# EAGLE design dc25-darknet-dialer-eaglev8 (EAGLE 7.7.0)
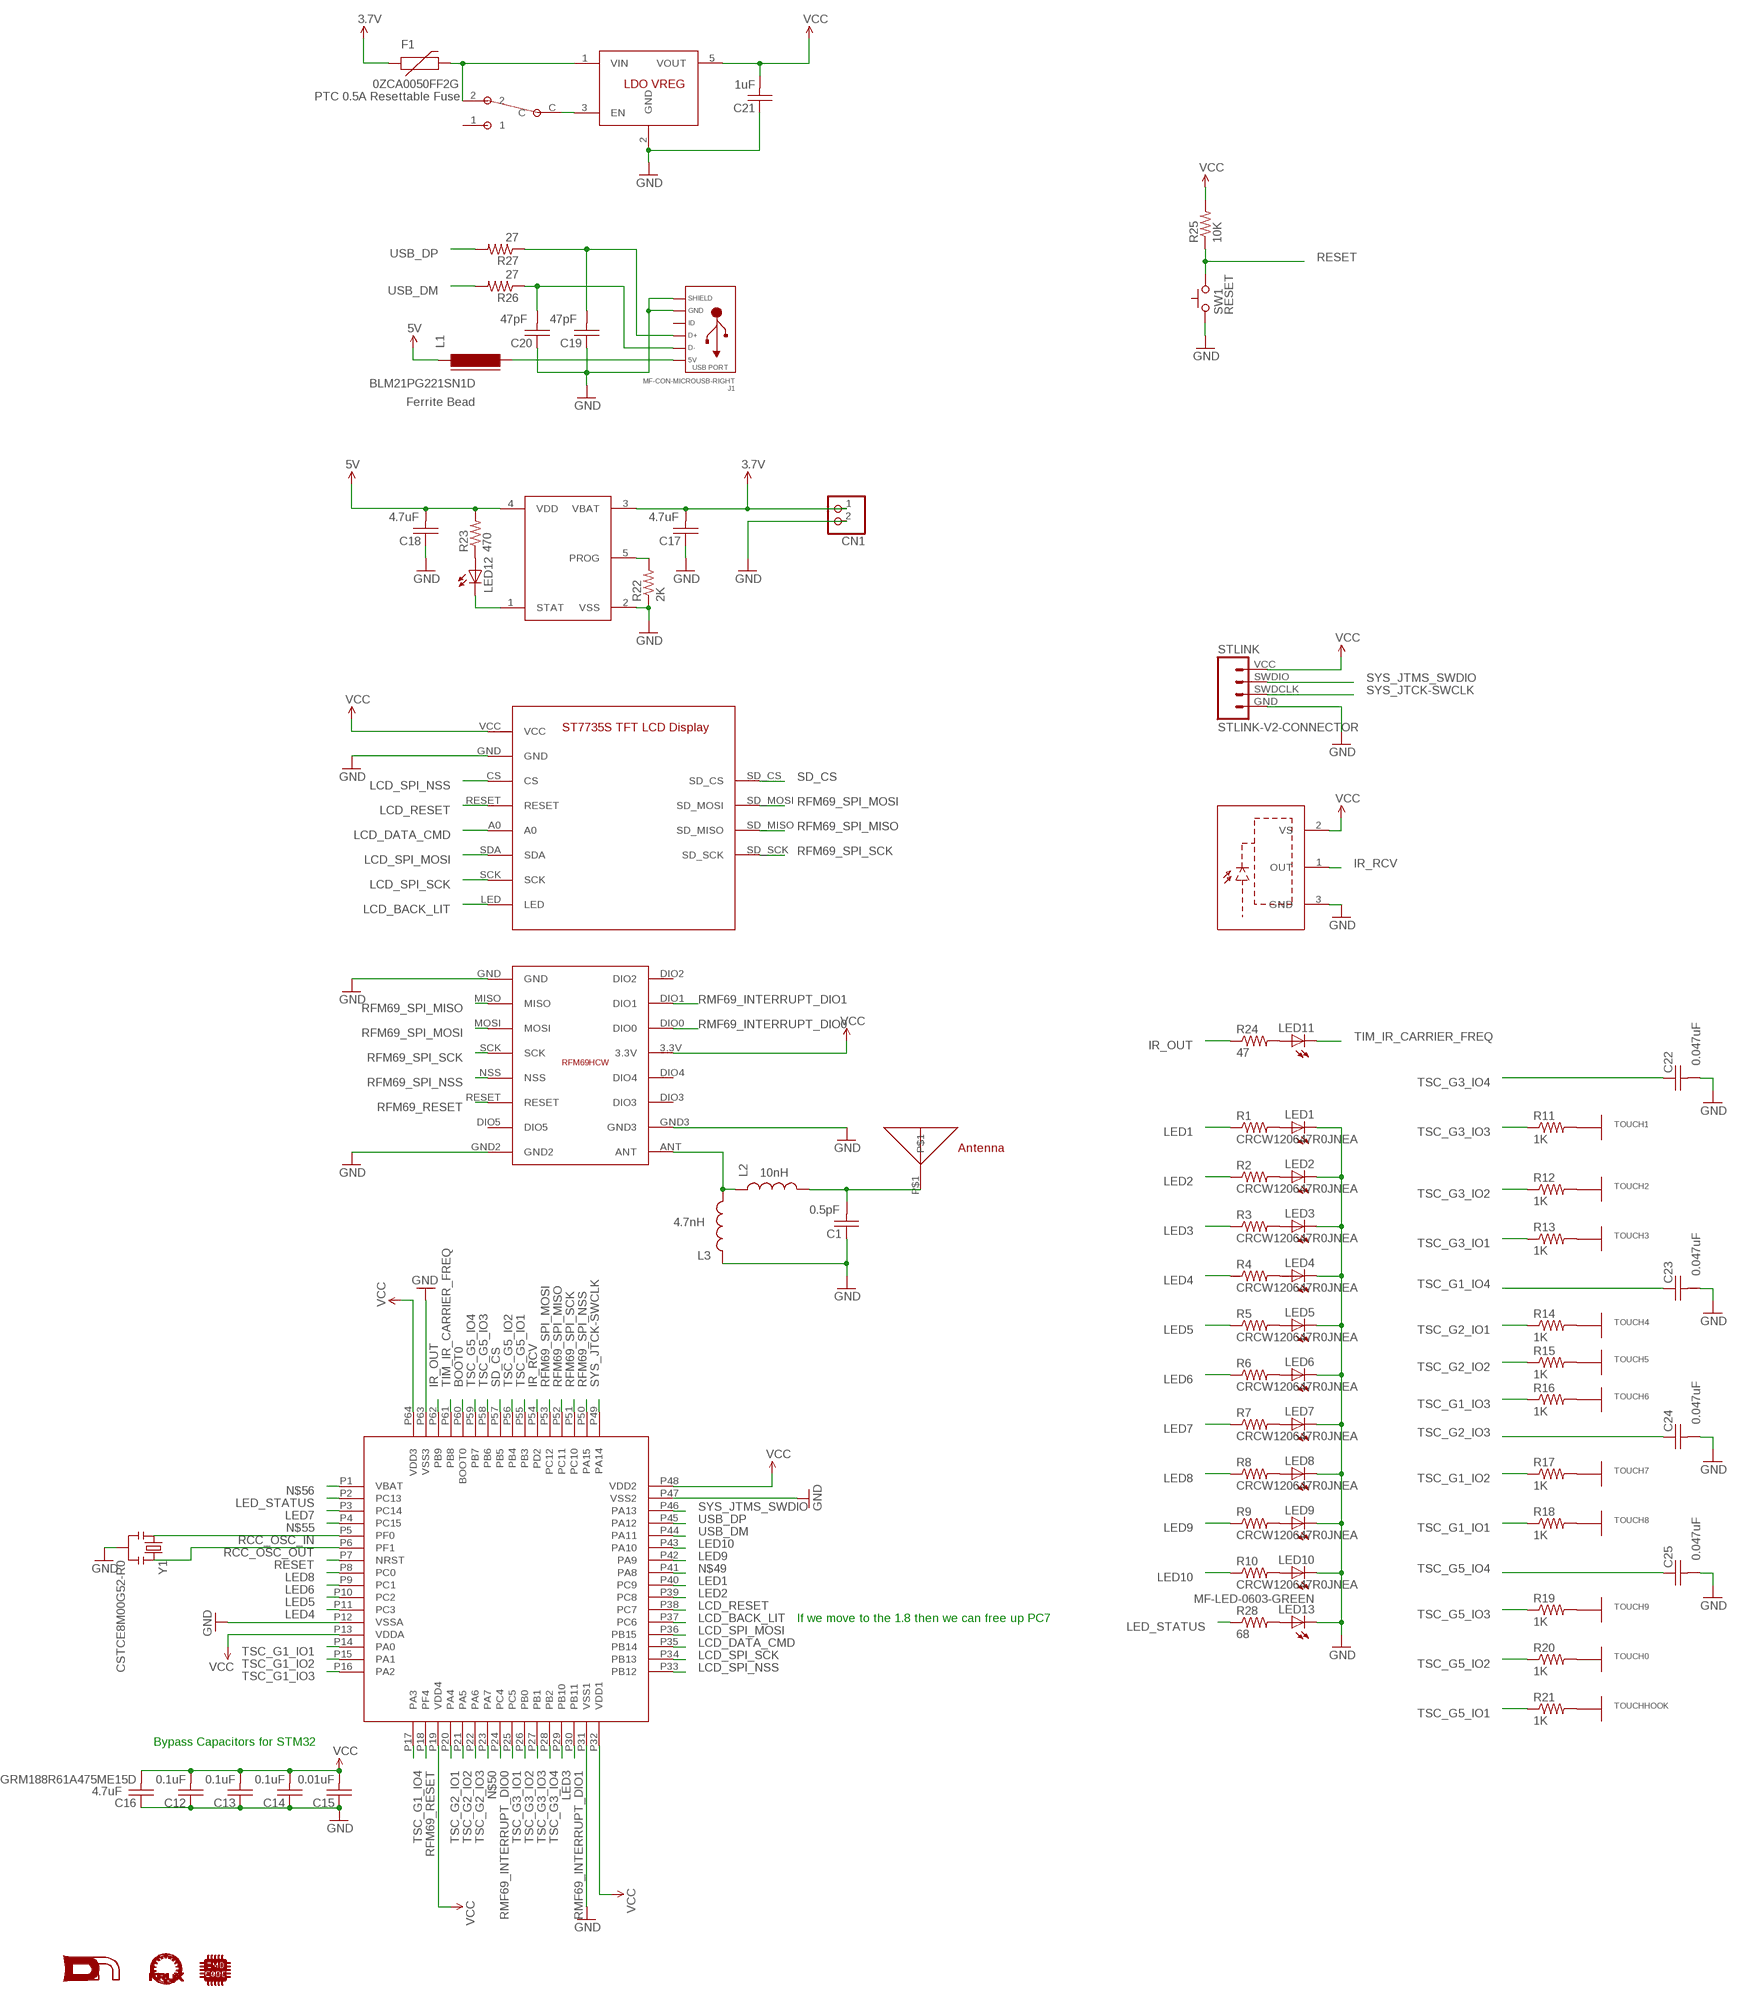
[diagram p0: schematic, sheet 1]

## Parts
C1  251R14S0R5BV4T  C-USC0603  [C0603]
C12  0.1uF  C-USC0603  [C0603]
C13  0.1uF  C-USC0603  [C0603]
C14  0.1uF  C-USC0603  [C0603]
C15  0.01uF  C-USC0603  [C0603]
C16  GRM188R61A475ME15D  C-USC0603  [C0603]
C17  GRM188R61A475ME15D  C-USC0603  [C0603]
C18  GRM188R61A475ME15D  C-USC0603  [C0603]
C19  C0603C470J3GACTU  C-USC0603  [C0603]
C20  C0603C470J3GACTU  C-USC0603  [C0603]
C21  1uF  C-USC0603  [C0603]
C22  C0603C473J3RACAUTO  C-USC0603  [C0603]
C23  C0603C473J3RACAUTO  C-USC0603  [C0603]
C24  C0603C473J3RACAUTO  C-USC0603  [C0603]
C25  C0603C473J3RACAUTO  C-USC0603  [C0603]
CN1  JST_2PIN-THM-RA  [JST-PH-2-THM-RA]
F1  0ZCA0050FF2G  PTCSMD  [PTC-1206]
J1  MF-CON-MICROUSB-RIGHT  USB_MICRO_RIGHT  [MICROUSB-RIGHT]
L1  BLM21PG221SN1D  FERRITE-0603  [FB603]
L2  CI160808-10NJ  INDUCTOR0603  [0603]
L3  CI160808-4N7D  INDUCTOR0603  [0603]
LED1  LEDREVERSEMOUNT  [GULLWING_LED]
LED2  LEDREVERSEMOUNT  [GULLWING_LED]
LED3  LEDREVERSEMOUNT  [GULLWING_LED]
LED4  LEDREVERSEMOUNT  [GULLWING_LED]
LED5  LEDREVERSEMOUNT  [GULLWING_LED]
LED6  LEDREVERSEMOUNT  [GULLWING_LED]
LED7  LEDREVERSEMOUNT  [GULLWING_LED]
LED8  LEDREVERSEMOUNT  [GULLWING_LED]
LED9  LEDREVERSEMOUNT  [GULLWING_LED]
LED10  LEDREVERSEMOUNT  [GULLWING_LED]
LED11  LED5MM  [LED5MM]
LED12  MF-LED-0603-GREEN  LED0603  [LED-0603]
LED13  MF-LED-0603-GREEN  LED0603  [LED-0603]
R1  CRCW120647R0JNEA  RESISTOR1206  [1206]
R2  CRCW120647R0JNEA  RESISTOR1206  [1206]
R3  CRCW120647R0JNEA  RESISTOR1206  [1206]
R4  CRCW120647R0JNEA  RESISTOR1206  [1206]
R5  CRCW120647R0JNEA  RESISTOR1206  [1206]
R6  CRCW120647R0JNEA  RESISTOR1206  [1206]
R7  CRCW120647R0JNEA  RESISTOR1206  [1206]
R8  CRCW120647R0JNEA  RESISTOR1206  [1206]
R9  CRCW120647R0JNEA  RESISTOR1206  [1206]
R10  CRCW120647R0JNEA  RESISTOR1206  [1206]
R11  1K  RESISTOR0603-RES  [0603-RES]
R12  1K  RESISTOR0603-RES  [0603-RES]
R13  1K  RESISTOR0603-RES  [0603-RES]
R14  1K  RESISTOR0603-RES  [0603-RES]
R15  1K  RESISTOR0603-RES  [0603-RES]
R16  1K  RESISTOR0603-RES  [0603-RES]
R17  1K  RESISTOR0603-RES  [0603-RES]
R18  1K  RESISTOR0603-RES  [0603-RES]
R19  1K  RESISTOR0603-RES  [0603-RES]
R20  1K  RESISTOR0603-RES  [0603-RES]
R21  1K  RESISTOR0603-RES  [0603-RES]
R22  2K  RESISTOR0603-RES  [0603-RES]
R23  470  RESISTOR0603-RES  [0603-RES]
R24  47  R-US_0207/7  [0207/7]
R25  10K  RESISTOR0603-RES  [0603-RES]
R26  27  RESISTOR0603-RES  [0603-RES]
R27  27  RESISTOR0603-RES  [0603-RES]
R28  68  RESISTOR0603-RES  [0603-RES]
STLINK  STLINK-V2-CONNECTOR  [1X04]
SW1  RESET  SWITCH_TACTILETACTILE-2PIN-NARROW  [TACTILE-2PIN-NARROW]
TOUCH0  CAP_TOUCH0  [CAP_TOUCH_PAD_0]
TOUCH1  CAP_TOUCH1  [CAP_TOUCH_PAD_1]
TOUCH2  CAP_TOUCH2  [CAP_TOUCH_PAD_2]
TOUCH3  CAP_TOUCH3  [CAP_TOUCH_PAD_3]
TOUCH4  CAP_TOUCH4  [CAP_TOUCH_PAD_4]
TOUCH5  CAP_TOUCH5  [CAP_TOUCH_PAD_5]
TOUCH6  CAP_TOUCH6  [CAP_TOUCH_PAD_6]
TOUCH7  CAP_TOUCH7  [CAP_TOUCH_PAD_7]
TOUCH8  CAP_TOUCH8  [CAP_TOUCH_PAD_8]
TOUCH9  CAP_TOUCH9  [CAP_TOUCH_PAD_9]
TOUCHHOOK  CAP_TOUCHHOOK  [CAP_TOUCH_PAD_HOOK]
U1  BU33SD5WG-TR  TLV702  [SOT23-5]
U2  MCP73831T-5ACI/OT  DS21984E  [SOT23-5]
U3  SOP22FLAT  [IR-MODULE_FLAT]
U$1  DN_LOGO  [DN_LOGO]
U$2  STM32F302RBT6  STM32F302XC  [LQFP64]
U$11  SWITCH_SPDT  [SPDT_SSAJ120100]
U$12  KRUX_LOGO  [KRUX_LOGO]
U$15  RFM69HCWRFN69HCWSMD  [16PIN-PCB-SMD]
U$21  0915AT43A0026E  CHIP_ANTENNA  [CHIP_ANTENNA_1.8X8MM]
U$22  ST7735S_LCD_MODULE  [ST7735S_LCD_DISPLAY]
U$23  CMD_C0DE_LOGO  [CMD_C0DE_LOGO]
Y1  CSTCE8M00G52-R0  RESONATORSMD  [RESONATOR-SMD]

## Nets
ANT: L2.1 L3.2 U$15.ANT
BOOT0: U$2.P60(BOOT0)
GND: C1.1 C12.1 C13.1 C14.1 C15.1 C16.1 C17.1 C18.1 C19.1 C20.1 C21.1 C22.2 C23.2 C24.2 C25.2 CN1.2 J1.5(GND) J1.S1(SLD) J1.S2(SLD) J1.S3(SLD) J1.S4(SLD) J1.S5(SLD) J1.S6(SLD) L3.1 LED1.C LED2.C LED3.C LED4.C LED5.C LED6.C LED7.C LED8.C LED9.C LED10.C LED13.C R22.1 STLINK.GND SW1.P$2(C) U1.2(GND) U2.2(VSS) U3.3(GND) U$2.P12(VSSA) U$2.P31(VSS1) U$2.P47(VSS2) U$2.P63(VSS3) U$15.GND U$15.GND2 U$15.GND3 U$22.GND Y1.2
IR_OUT: R24.1 U$2.P62(PB9)
IR_RCV: U3.1(OUT) U$2.P54(PD2)
LCD_BACK_LIT: U$2.P37(PC6) U$22.LED
LCD_DATA_CMD: U$2.P35(PB14) U$22.A0
LCD_RESET: U$2.P38(PC7) U$22.RESET
LCD_SPI_MOSI: U$2.P36(PB15) U$22.SDA
LCD_SPI_NSS: U$2.P33(PB12) U$22.CS
LCD_SPI_SCK: U$2.P34(PB13) U$22.SCK
LED1: R1.1 U$2.P40(PC9)
LED2: R2.1 U$2.P39(PC8)
LED3: R3.1 U$2.P29(PB10)
LED4: R4.1 U$2.P11(PC3)
LED5: R5.1 U$2.P10(PC2)
LED6: R6.1 U$2.P9(PC1)
LED7: R7.1 U$2.P3(PC14)
LED8: R8.1 U$2.P8(PC0)
LED9: R9.1 U$2.P42(PA9)
LED10: R10.1 U$2.P43(PA10)
LED_STATUS: R28.1 U$2.P2(PC13)
N$1: R11.2 TOUCH1.PAD(TOUCH)
N$2: R12.2 TOUCH2.PAD(TOUCH)
N$3: R13.2 TOUCH3.PAD(TOUCH)
N$4: R14.2 TOUCH4.PAD(TOUCH)
N$5: R15.2 TOUCH5.PAD(TOUCH)
N$6: R16.2 TOUCH6.PAD(TOUCH)
N$7: R17.2 TOUCH7.PAD(TOUCH)
N$8: R18.2 TOUCH8.PAD(TOUCH)
N$9: R19.2 TOUCH9.PAD(TOUCH)
N$10: R20.2 TOUCH0.PAD(TOUCH)
N$11: R21.2 TOUCHHOOK.P$1(TOUCH)
N$12: LED1.A R1.2
N$13: LED2.A R2.2
N$14: LED3.A R3.2
N$15: LED4.A R4.2
N$16: LED5.A R5.2
N$17: LED6.A R6.2
N$18: LED7.A R7.2
N$19: LED8.A R8.2
N$20: LED9.A R9.2
N$21: LED10.A R10.2
N$22: R22.2 U2.5(PROG)
N$23: LED11.A R24.2
N$24: LED12.A R23.1
N$25: LED12.C U2.1(STAT)
N$26: C19.2 J1.3(D+) R27.1
N$27: C20.2 J1.2(D-) R26.1
N$28: J1.1(5V) L1.2
N$29: LED13.A R28.2
N$30: F1.2 U1.1(VIN) U$11.2
N$31: C1.2 L2.2 U$21.P$1
N$32: U1.3(EN) U$11.C
N$49: U$2.P41(PA8)
N$50: U$2.P23(PA7)
N$55: U$2.P4(PC15)
N$56: U$2.P1(VBAT)
RCC_OSC_IN: U$2.P5(PF0) Y1.1
RCC_OSC_OUT: U$2.P6(PF1) Y1.3
RESET: R25.1 SW1.P$1(A) U$2.P7(NRST)
RFM69_RESET: U$2.P18(PF4) U$15.RESET
RFM69_SPI_MISO: U$2.P52(PC11) U$15.MISO U$22.SD_MISO
RFM69_SPI_MOSI: U$2.P53(PC12) U$15.MOSI U$22.SD_MOSI
RFM69_SPI_NSS: U$2.P50(PA15) U$15.NSS
RFM69_SPI_SCK: U$2.P51(PC10) U$15.SCK U$22.SD_SCK
RMF69_INTERRUPT_DIO0: U$2.P24(PC4) U$15.DIO0
RMF69_INTERRUPT_DIO1: U$2.P30(PB11) U$15.DIO1
SD_CS: U$2.P57(PB5) U$22.SD_CS
SYS_JTCK-SWCLK: STLINK.SWDCLK U$2.P49(PA14)
SYS_JTMS_SWDIO: STLINK.SWDIO U$2.P46(PA13)
TIM_IR_CARRIER_FREQ: LED11.K(C) U$2.P61(PB8)
TSC_G1_IO1: R18.1 U$2.P14(PA0)
TSC_G1_IO2: R17.1 U$2.P15(PA1)
TSC_G1_IO3: R16.1 U$2.P16(PA2)
TSC_G1_IO4: C23.1 U$2.P17(PA3)
TSC_G2_IO1: R14.1 U$2.P20(PA4)
TSC_G2_IO2: R15.1 U$2.P21(PA5)
TSC_G2_IO3: C24.1 U$2.P22(PA6)
TSC_G3_IO1: R13.1 U$2.P25(PC5)
TSC_G3_IO2: R12.1 U$2.P26(PB0)
TSC_G3_IO3: R11.1 U$2.P27(PB1)
TSC_G3_IO4: C22.1 U$2.P28(PB2)
TSC_G5_IO1: R21.1 U$2.P55(PB3)
TSC_G5_IO2: R20.1 U$2.P56(PB4)
TSC_G5_IO3: R19.1 U$2.P58(PB6)
TSC_G5_IO4: C25.1 U$2.P59(PB7)
USB_DM: R26.2 U$2.P44(PA11)
USB_DP: R27.2 U$2.P45(PA12)
VCC: C12.2 C13.2 C14.2 C15.2 C16.2 C21.2 R25.2 STLINK.VCC U1.5(VOUT) U3.2(VS) U$2.P13(VDDA) U$2.P19(VDD4) U$2.P32(VDD1) U$2.P48(VDD2) U$2.P64(VDD3) U$15.3.3V U$22.VCC
VCC0: C18.2 L1.1 R23.2 U2.4(VDD) ; supply symbol labelled 5V
VCC1: C17.2 CN1.1 F1.1 U2.3(VBAT) ; supply symbol labelled 3.7V
Unconnected: J1.4(ID) U$11.1 U$15.DIO2 U$15.DIO3 U$15.DIO4 U$15.DIO5

## Notes on the sheet
- PTC 0.5A Resettable Fuse
- 47pF | 47pF
- Ferrite Bead
- 4.7uF | 4.7uF
- 0.047uF
- 10nH
- 0.5pF
- 4.7nH
- 0.047uF
- 0.047uF
- 0.047uF
- If we move to the 1.8 then we can free up PC7
- Bypass Capacitors for STM32
- 4.7uF

## Library data of the parts
C1 C12-C25 = darknet_parts_library:C-US: CAPACITOR, American symbol
CN1 = adafruit:JST_2PIN: JST 2-Pin Connectors of various flavors SMT-RA (S2B-PH-SM4) 4UConnector #17311 SMT (B2B-PH-SM4) THM-RA (S2B-PH) THM (B2B-PH)
F1 = SparkFun:PTC: Resettable Fuse PTC Resettable Fuse. Spark Fun Electronics SKU : COM-08357
J1 = MF_Connectors:USB: Library: MF_Connectors Description: 5 Pin USB Connectors. SLD is the shield connection. Usually tied to ground through a small ferrite bead.; HOUSEPART: YES; MPN: MF-CON-MICROUSB-RIGHT; POPULATE: 1; URL: https://factory.macrofab.com/part/MF-CON-MICROUSB-RIGHT
L1 = dp_devices:FERRITE: Ferrite bead in various packages
L2 L3 = darknet_parts_library:INDUCTOR: Inductors Basic Inductor/Choke - 0603 and 1206. Footprints are not proven and vary greatly between part numbers.
LED1-LED13 = SYNShop:LED: LEDs Standard schematic elements and footprints for 5mm, 3mm, 1206, and 0603 sized LEDs. 5mm - Spark Fun Electronics SKU : COM-00529 (and others)
R1-R23 R25-R28 = darknet_parts_library:RESISTOR: Resistor Basic schematic elements and footprints for 0603, 1206, and PTH resistors.
R24 = darknet_parts_library:R-US_: RESISTOR, American symbol
STLINK = darknet_parts_library:STLINK-V2-CONNECTOR
SW1 = SYNShop:SWITCH_TACTILE
TOUCH0 TOUCH1-TOUCH9 TOUCHHOOK = darknet_parts_library:CAP_TOUCH
U1 = darknet_parts_library:TLV702
U2 = darknet_parts_library:DS21984E
U3 = darknet_parts_library:SOP22
U$1 = SYNShop:DN_LOGO
U$2 = darknet_parts_library:STM32F302XC
U$11 = darknet_parts_library:SWITCH_SPDT
U$12 = darknet_parts_library:KRUX_LOGO
U$15 = SYNShop:RFM69HCW
U$21 = darknet_parts_library:CHIP_ANTENNA
U$22 = darknet_parts_library:ST7735S_LCD_MODULE
U$23 = darknet_parts_library:CMD_C0DE_LOGO
Y1 = SparkFun:RESONATOR: Resonator Small SMD resonator. This is the itty bitty 10/20MHz resonators with built in caps. CSTCE10M0G55 and CSTCE20M0V53. Footprint has been reviewed closely but hasn't been tested yet.

## Board
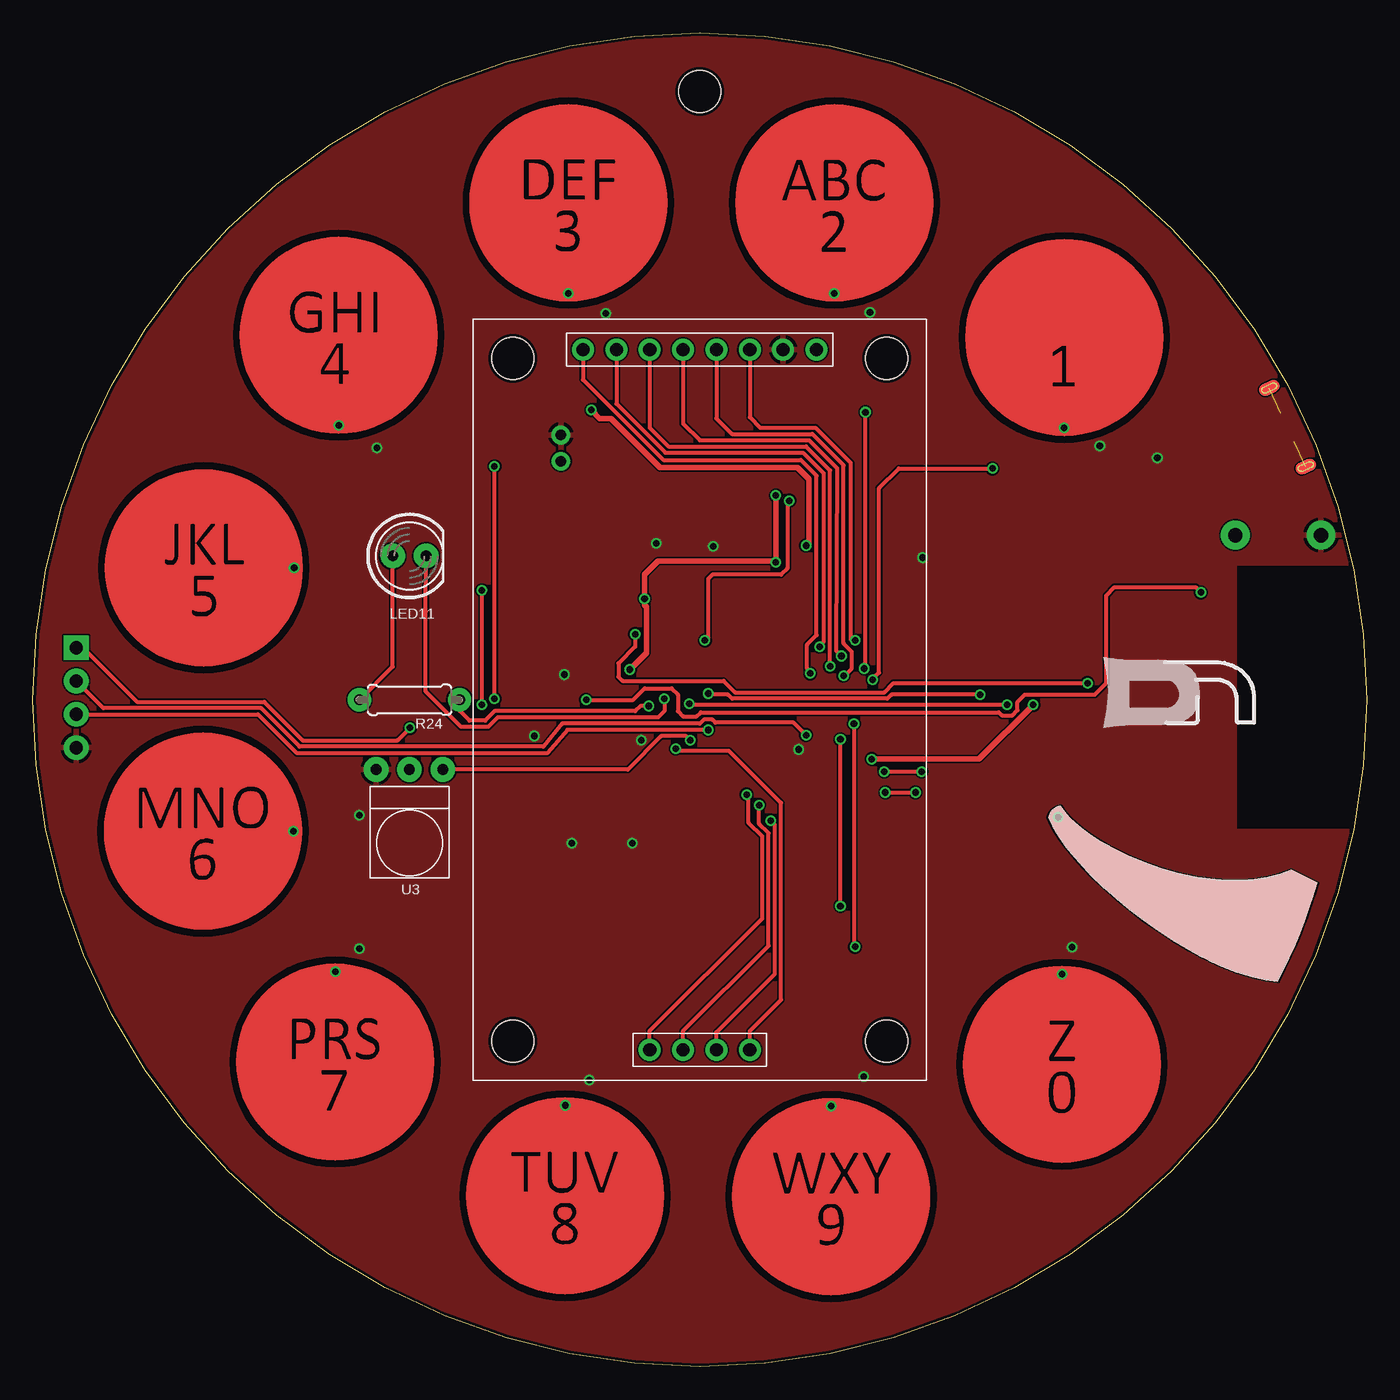
[diagram p1: board, top side]
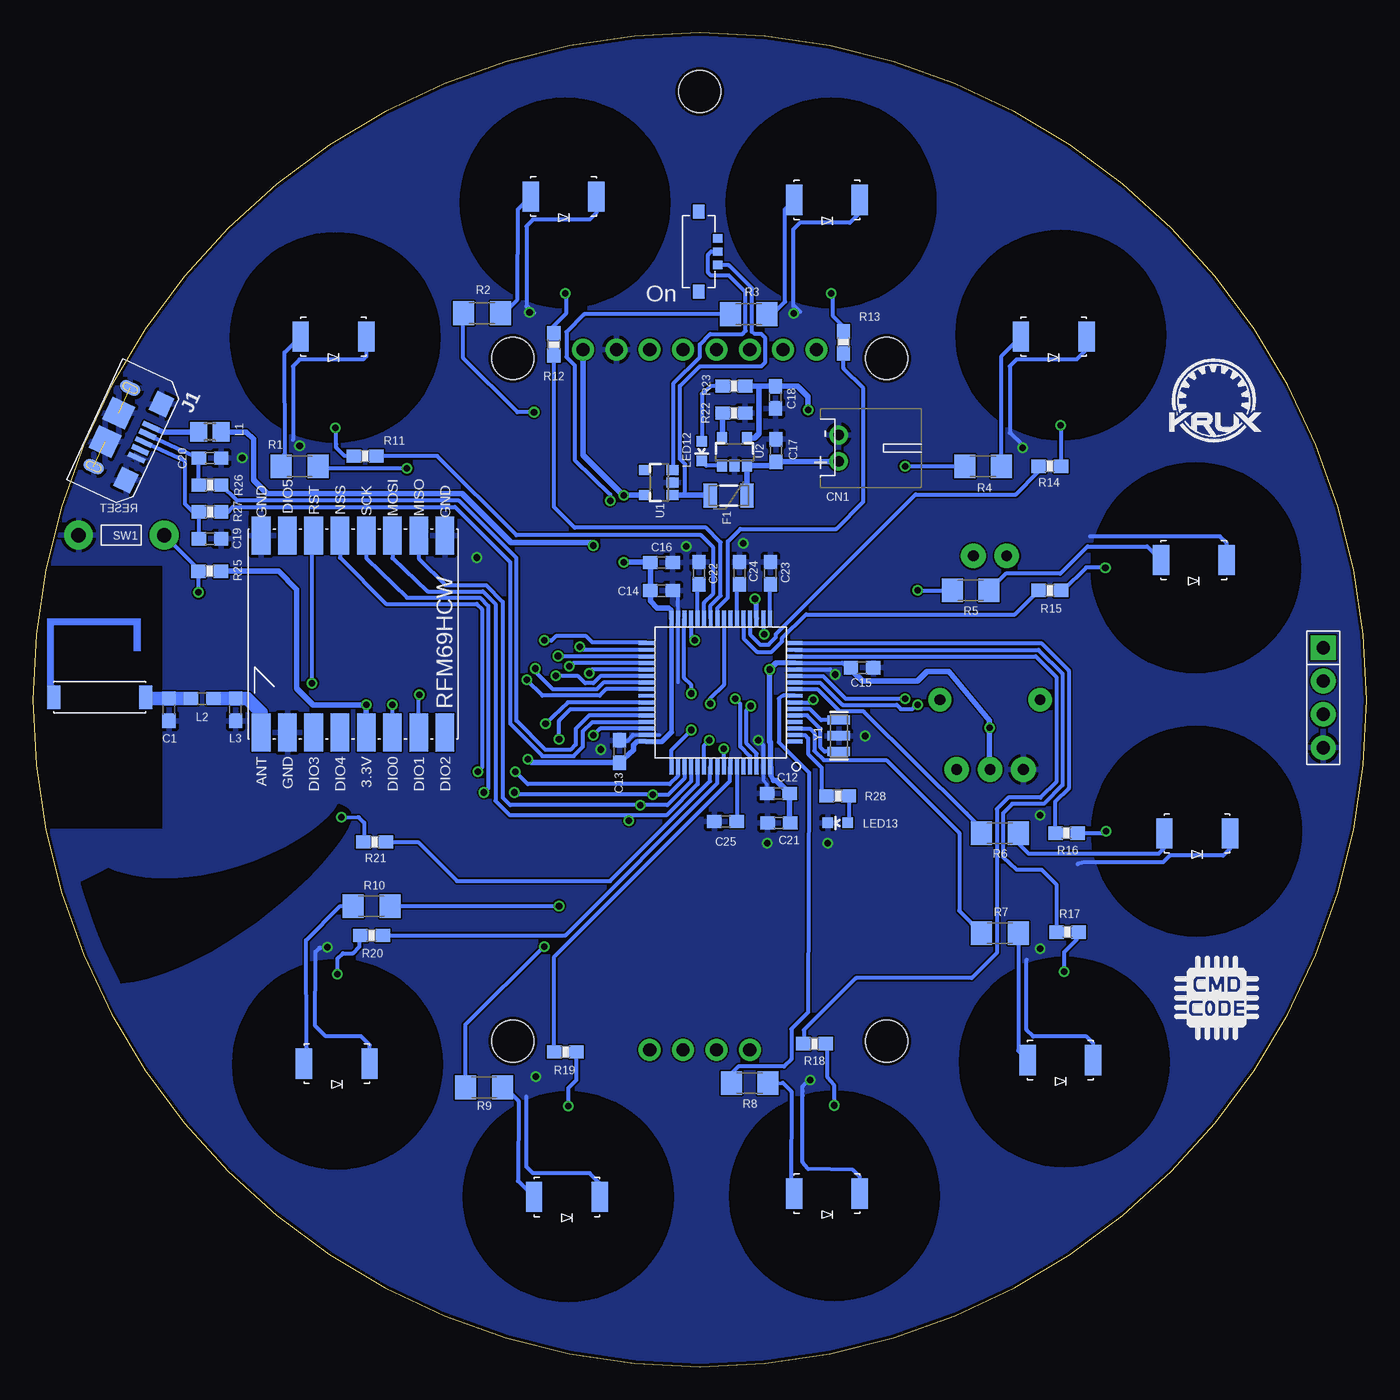
[diagram p2: board, bottom side, seen from below]

Size 101.6 x 101.6 mm. Coordinates in mm from the lower left corner, seen from the top.
Outline: 50.8,101.6 arc-180 50.8,0 arc-180 50.8,101.6
Copper layers (1*16): Top 0.035mm / dielectric 1.5mm / Bottom 0.035mm
Design rules "MF_Standard_2_Layer": minimum track width 5mil, minimum drill 12mil, track to track 5mil, track to pad 5mil, pad to pad 5mil, via to via 5mil, smd to smd 0mil, copper to edge 10mil, drill to drill 10mil, minimum pad ring 6mil, minimum via ring 6mil, stop-mask expansion 2mil, vias tented up to drill 25mil, thermal gap 10mil
Holes 3.2 mm at 50.8,97.12

### Footprints (pad centres in the part's own frame; a part is rotated, then mirrored left to right if it is on the bottom)
C0603 = smd 1.1 x 1: 1 -0.85,0; 2 0.85,0
JST-PH-2-THM-RA = drill 0.8 pad 1.422: 1 1,0; 2 -1,0
PTC-1206 = smd 1 x 1.8: 1 -1.4,0; 2 1.4,0
MICROUSB-RIGHT = smd 0.4 x 1.35: 1 -1.3,1.27; 2 -0.65,1.27; 3 0,1.27; 4 0.65,1.27; 5 1.3,1.27 | smd 0.9 x 1.6: S1 -3.3,-1.4; S2 3.3,-1.4 | smd 1.6 x 1.4: S3 -3.2,1.27; S4 3.2,1.27 | smd 1.9 x 1.9: S5 -1.2,-1.405; S6 1.2,-1.405 | smd 0.9 x 1.6 bottom: S7 -3.3,-1.4; S8 3.3,-1.4
FB603 = smd 1.3 x 1.5: 1 -0.85,0; 2 0.85,0
0603 = smd 1.1 x 1: 1 -0.85,0; 2 0.85,0
GULLWING_LED = smd 1.245 x 2.3: A 5,-1.5; C 0,-1.5
LED5MM = drill 0.813 pad 1.88: A -1.27,0; K 1.27,0
LED-0603 = smd 0.8 x 0.8: A 0,-0.75; C 0,0.75
1206 = smd 1.6 x 1.8: 1 -1.4,0; 2 1.4,0
0603-RES = smd 1.1 x 1: 1 -0.85,0; 2 0.85,0
0207/7 = drill 0.813 pad 1.778: 1 -3.81,0; 2 3.81,0
1X04 = drill 1.016 pad 1.88: GND 2.54,0; SWDCLK 0,0; SWDIO -2.54,0 | drill 1.016 pad 1.88 square: VCC -5.08,0
TACTILE-2PIN-NARROW = drill 1.1 pad 2.184: P$1 3.264,0; P$2 -3.264,0
CAP_TOUCH_PAD_0 = drill 0.5: PAD 0,6.881
CAP_TOUCH_PAD_1 = drill 0.5: PAD 0,-6.881
CAP_TOUCH_PAD_2 = drill 0.5: PAD 0,-6.881
CAP_TOUCH_PAD_3 = drill 0.5: PAD 0,-6.881
CAP_TOUCH_PAD_4 = drill 0.5: PAD 0,-6.881
CAP_TOUCH_PAD_5 = drill 0.5: PAD 6.881,0
CAP_TOUCH_PAD_6 = drill 0.5: PAD 6.881,0
CAP_TOUCH_PAD_7 = drill 0.5: PAD 0,6.881
CAP_TOUCH_PAD_8 = drill 0.5: PAD 0,6.881
CAP_TOUCH_PAD_9 = drill 0.5: PAD 0,6.881
CAP_TOUCH_PAD_HOOK = drill 0.5: P$1 -8,6.3
SOT23-5 = smd 0.75 x 0.9: 1 -0.95,-1; 2 0,-1; 3 0.95,-1; 4 0.95,1.1; 5 -0.95,1.1
IR-MODULE_FLAT = drill 0.813 pad 1.88: 1 -2.54,0; 2 0,0; 3 2.54,0
LQFP64 = smd 1.2 x 0.3: P1 -5.65,3.75; P2 -5.65,3.25; P3 -5.65,2.75; P4 -5.65,2.25; P5 -5.65,1.75; P6 -5.65,1.25; P7 -5.65,0.75; P8 -5.65,0.25; P9 -5.65,-0.25; P10 -5.65,-0.75; P11 -5.65,-1.25; P12 -5.65,-1.75; P13 -5.65,-2.25; P14 -5.65,-2.75; P15 -5.65,-3.25; P16 -5.65,-3.75; P33 5.65,-3.75; P34 5.65,-3.25; P35 5.65,-2.75; P36 5.65,-2.25; P37 5.65,-1.75; P38 5.65,-1.25; P39 5.65,-0.75; P40 5.65,-0.25; P41 5.65,0.25; P42 5.65,0.75; P43 5.65,1.25; P44 5.65,1.75; P45 5.65,2.25; P46 5.65,2.75; P47 5.65,3.25; P48 5.65,3.75 | smd 0.3 x 1.2: P17 -3.75,-5.65; P18 -3.25,-5.65; P19 -2.75,-5.65; P20 -2.25,-5.65; P21 -1.75,-5.65; P22 -1.25,-5.65; P23 -0.75,-5.65; P24 -0.25,-5.65; P25 0.25,-5.65; P26 0.75,-5.65; P27 1.25,-5.65; P28 1.75,-5.65; P29 2.25,-5.65; P30 2.75,-5.65; P31 3.25,-5.65; P32 3.75,-5.65; P49 3.75,5.65; P50 3.25,5.65; P51 2.75,5.65; P52 2.25,5.65; P53 1.75,5.65; P54 1.25,5.65; P55 0.75,5.65; P56 0.25,5.65; P57 -0.25,5.65; P58 -0.75,5.65; P59 -1.25,5.65; P60 -1.75,5.65; P61 -2.25,5.65; P62 -2.75,5.65; P63 -3.25,5.65; P64 -3.75,5.65
SPDT_SSAJ120100 = smd 0.635 x 0.7: 1 -1,1.45; 2 1,1.45; C 0,1.45 | smd 1.05 x 0.9: MNT1 -3.05,0; MNT2 3.05,0
16PIN-PCB-SMD = smd 2.9 x 1.422: 3.3V 7.5,1; ANT 7.5,-7; DIO0 7.5,3; DIO1 7.5,5; DIO2 7.5,7; DIO3 7.5,-3; DIO4 7.5,-1; DIO5 -7.5,-5; GND -7.5,7; GND2 -7.5,-7; GND3 7.5,-5; MISO -7.5,5; MOSI -7.5,3; NSS -7.5,-1; RESET -7.5,-3; SCK -7.5,1
CHIP_ANTENNA_1.8X8MM = smd 1 x 1.8: P$1 -3.5,0; P$2 3.5,0
ST7735S_LCD_DISPLAY = drill 1 pad 1.676: A0 1.27,-26.67; CS -3.81,-26.67; GND -6.35,-26.67; LED 8.89,-26.67; RESET -1.27,-26.67; SCK 6.35,-26.67; SD_CS -3.81,26.67; SD_MISO 1.27,26.67; SD_MOSI -1.27,26.67; SD_SCK 3.81,26.67; SDA 3.81,-26.67; VCC -8.89,-26.67 | hole 3.2: -14.25,26; 14.25,26; 14.25,-26; -14.25,-26
RESONATOR-SMD = smd 0.7 x 1.7: 1 -1.2,0; 2 0,0; 3 1.2,0

### Placement (x,y rotation side)
C1  91.23,50.04 90 bottom
C12  44.81,43.66 0 bottom
C13  56.91,46.85 270 bottom
C14  53.71,59.1 180 bottom
C15  38.43,53.24 180 bottom
C16  53.71,61.26 180 bottom
C17  45,69.79 270 bottom
C18  45.05,73.84 90 bottom
C19  88.1,63.06 180 bottom
C20  88.1,69.21 180 bottom
C21  44.77,41.42 0 bottom
C22  50.85,60.44 90 bottom
C23  45.42,60.44 90 bottom
C24  47.77,60.44 90 bottom
C25  48.83,41.53 180 bottom
CN1  40.22,69.97 270 bottom
F1  48.6,66.35 180 bottom
J1  94.3,70.96 245 bottom
L1  88.1,71.2 180 bottom
L2  88.7,50.88 180 bottom
L3  86.16,50.04 90 bottom
LED1  76.2,76.96 180 bottom
LED2  58.67,87.63 180 bottom
LED3  38.61,87.38 180 bottom
LED4  21.34,76.96 180 bottom
LED5  10.67,59.94 180 bottom
LED6  10.41,39.12 180 bottom
LED7  20.83,21.84 180 bottom
LED8  38.61,11.68 180 bottom
LED9  58.42,11.43 180 bottom
LED10  75.95,21.59 180 bottom
LED11  28.69,61.75 0 top
LED12  50.65,69.74 180 bottom
LED13  40.3,41.42 90 bottom
R1  81.28,68.58 180 bottom
R2  67.39,80.25 0 bottom
R3  47.07,80.17 0 bottom
R4  29.21,68.58 0 bottom
R5  30.16,59.13 0 bottom
R6  27.94,40.64 0 bottom
R7  27.94,33.02 0 bottom
R8  46.99,21.59 0 bottom
R9  67.23,21.27 0 bottom
R10  75.8,35.08 180 bottom
R11  76.28,69.37 180 bottom
R12  61.91,77.87 90 bottom
R13  39.85,78.03 90 bottom
R14  24.13,68.58 0 bottom
R15  24.13,59.13 0 bottom
R16  22.86,40.64 0 bottom
R17  22.78,33.1 0 bottom
R18  42.07,24.61 0 bottom
R19  61.04,23.97 0 bottom
R20  75.8,32.86 180 bottom
R21  75.56,39.97 180 bottom
R22  48.2,72.64 180 bottom
R23  48.2,74.69 0 bottom
R24  28.69,50.8 180 top
R25  88.13,60.59 0 bottom
R26  88.1,67.16 0 bottom
R27  88.1,65.11 0 bottom
R28  40.29,43.48 0 bottom
STLINK  3.31,49.69 270 bottom
SW1  94.86,63.34 0 bottom
TOUCH0  78.39,23.03 0 top
TOUCH1  78.57,78.39 0 top
TOUCH2  61.05,88.64 0 top
TOUCH3  40.79,88.64 0 top
TOUCH4  23.3,78.57 0 top
TOUCH5  13.02,60.85 0 top
TOUCH6  12.96,40.79 0 top
TOUCH7  23.03,23.21 0 top
TOUCH8  40.55,13.02 0 top
TOUCH9  60.81,12.96 0 top
TOUCHHOOK  86.11,35.56 0 top
U1  53.88,67.35 90 bottom
U2  48.15,69.64 0 bottom
U3  28.69,45.48 180 top
U$1  81.15,48.76 0 top
U$2  49.21,51.35 180 bottom
U$11  50.88,84.93 270 bottom
U$12  11.67,73.66 0 bottom
U$15  77.2,55.8 270 bottom
U$21  96.5,51 180 bottom
U$22  50.8,50.8 180 top
U$23  11.43,28.42 0 bottom
Y1  40.21,48.05 90 bottom

### Tracks (layer width: path | path; a pad name or v marks a point on that pad's centre or on a via)
ANT
  Bottom 0.813: 87.84,50.89 L2.1
  Bottom 1.016: 87.84,50.89 L3.2 85.26,50.89 84.22,49.85 84.22,48.31 U$15.ANT
GND  (via drill 0.5)  (2 unrouted)
  Bottom 0.254: U$2.P47 55.91,48.12 55.91,48.1 53.86,48.1 | U$2.P63 45.96,44.66 45.66,44.35 C12.1 | 52.46,52.11 U$2.P31 52.46,57.95
  Bottom 0.305: LED10.C 75.95,24.51 76.6,25.16 79.3,25.16 80.09,25.96 80.07,31.24 80.07,31.61 79.77,31.91 79.69,31.91 79.77,31.83 | LED9.C 58.42,13.97 59.18,14.73 63.5,14.73 64.01,15.24 64.01,20.57 | LED8.C 38.61,14.48 39.12,14.99 42.55,15.06 42.97,15.57 42.97,20.65 42.96,20.99 42.96,21.34 42.31,21.99 42.31,22.07 | LED7.C 20.83,24.64 21.34,25.15 25.4,25.15 25.91,25.65 25.91,30.99 | LED6.C 10.41,39.45 10.92,38.92 14.99,38.92 15.51,38.42 21.53,38.42 22.03,38.28 | LED5.C 10.67,62.74 11.18,63.25 21.08,63.25 | LED4.C 21.34,77.47 22.1,76.71 26.67,76.71 27.18,76.2 27.18,71.12 27.12,71.12 26.35,70.35 | LED3.C 38.61,87.88 39.37,87.12 43.18,87.12 43.69,86.61 43.69,80.77 43.57,80.77 43.15,80.35 | LED2.C 58.67,87.88 59.18,87.38 63.5,87.38 64.01,86.87 64.01,80.77 63.92,80.77 63.4,80.25 | LED1.C 76.2,76.96 76.45,76.71 81.28,76.71 81.79,76.2 81.79,70.61 | 52.46,57.95 52.46,58.7 C14.1 | U$2.P12 40.87,53.1 v40.49,52.73 | 55.91,48.12 55.91,48.07 56.36,47.62 56.83,47.62 C13.1 | U$2.P63 45.96,46.91 45.96,47.32 v46.36,47.72
  other vias: 63.76,80.3 43.65,80.22 26.2,70 24.87,31.83 42.38,21.84 63.3,22.1 79.16,31.94 81.28,70.13 24.87,41.99 38.19,48.04 58.35,47.01 67.78,61.63 41.04,39.87 45.65,39.87 85.65,69.23 51.84,62.49 47.47,62.73
  pour Top: 0,50.8 arc-90 50.8,101.6 arc-90 101.6,50.8 arc-90 50.8,0 arc-90
  pour Bottom: 50.8,101.6 arc90 0,50.8 arc90 50.8,0 arc90 101.6,50.8 arc90
IR_OUT  (via drill 0.5)
  Top 0.305: v46.91,50.32 46.28,50.32 45.88,49.93 35.16,49.93 34.45,49.21 33.26,49.21 32.54,49.93 32.54,50.76 R24.1
  Bottom 0.305: U$2.P62 46.46,46.7 47.23,47.47 47.23,50.01 v46.91,50.32
IR_RCV  (via drill 0.5)
  Top 0.305: v50.09,47.7 49.77,48.02 47.86,48.02 45.32,45.48 U3.1
  Bottom 0.305: U$2.P54 50.46,47.33 v50.09,47.7
LCD_BACK_LIT  (via drill 0.5 pad 0.3)
  Top 0.305: U$22.LED 41.91,75.17 48.02,69.06 58.5,69.06 59.69,67.87 59.69,55.72 58.98,55.01 58.98,53.18 v59.21,52.8
  Bottom 0.305: U$2.P37 58.97,53.1 v59.21,52.8
LCD_DATA_CMD  (via drill 0.5 pad 0.3)
  Top 0.305: U$22.A0 49.53,71.83 50.8,70.56 59.13,70.56 61.28,68.42 61.2,54.69 61.2,54.53 v61.59,54.13
  Bottom 0.305: U$2.P35 61.25,54.1 v61.59,54.13
LCD_RESET  (via drill 0.5 pad 0.3)
  Top 0.305: U$22.RESET 52.07,72.23 53.26,71.04 59.37,71.04 61.75,68.66 61.75,55.09 62.39,54.45 62.39,53.18 61.83,52.63 v61.75,52.63
  Bottom 0.305: v61.75,52.63 61.73,52.6 60.07,52.6 59.53,52.07 58.9,52.07 58.36,52.6 U$2.P38
LCD_SPI_MOSI  (via drill 0.5 pad 0.3)
  Top 0.305: U$22.SDA 46.99,71.52 48.42,70.09 58.9,70.09 60.72,68.26 v60.72,53.34
  Bottom 0.305: U$2.P36 60.4,53.6 60.77,53.29 60.75,53.29 v60.72,53.34
LCD_SPI_NSS  (via drill 0.5 pad 0.3)
  Top 0.305: U$22.CS 54.61,72.31 55.4,71.52 59.61,71.52 62.31,68.82 62.31,55.4 62.47,55.24 v62.63,55.32
  Bottom 0.305: U$2.P33 54.93,55.17 58.98,55.17 59.45,55.64 61.75,55.64 62.09,55.31 62.53,55.31 v62.63,55.32 62.57,55.26
LCD_SPI_SCK  (via drill 0.5 pad 0.3)
  Top 0.305: U$22.SCK 44.45,73.34 48.18,69.61 58.66,69.61 60.25,68.02 60.25,55.24 v59.93,54.85
  Bottom 0.305: U$2.P34 59.69,54.6 v59.93,54.85
LED1  (via drill 0.5 pad 0.3)
  Top 0.305: v63.98,52.31 63.98,52.39 64.45,52.86 64.45,66.91 65.96,68.42 v73.1,68.42
  Bottom 0.305: U$2.P40 57.93,51.6 58.42,51.12 62.79,51.12 v63.98,52.31 | v73.1,68.42 79.14,68.42 79.3,68.58 R1.1
LED2  (via drill 0.5 pad 0.3)
  Top 0.305: v63.34,53.18 63.42,53.26 v63.42,72.71
  Bottom 0.305: U$2.P39 58.15,52.1 58.66,51.59 61.99,51.59 63.18,52.78 63.18,52.86 63.34,53.02 v63.34,53.18 | v63.42,72.71 64.69,72.71 68.82,76.83 68.82,80.22 R2.1
LED3  (via drill 0.5 pad 0.3)
  Top 0.305: v57.63,65.96 57.63,65.88 57.47,65.72 57.47,60.8 56.99,60.33 51.75,60.33 51.44,60.01 51.44,55.48 v51.2,55.32
  Bottom 0.305: R3.1 59.61,80.17 60.96,78.82 60.96,76.91 60.33,76.28 60.33,69.06 57.63,66.44 v57.63,65.96 | v51.2,55.32 51.44,55.48 51.44,56.98 U$2.P29
LED4  (via drill 0.5)
  Top 0.305: v35.16,50.88 v35.16,68.58
  Bottom 0.305: 30.63,68.6 R4.1 v35.16,68.58 | U$2.P11 41.41,52.6 39.69,50.88 v35.16,50.88
LED5  (via drill 0.5)
  Top 0.305: v34.21,50.4 v34.21,59.13
  Bottom 0.305: 31.51,59.08 R5.1 v34.21,59.13 | U$2.P10 41.63,52.1 39.93,50.4 35.8,50.4 35.48,50.09 34.61,50.09 34.29,50.4 v34.21,50.4
LED6
  Bottom 0.305: U$2.P9 41.84,51.6 40.16,49.93 38.34,49.93 38.26,49.85 30.48,42.15 29.34,41.01 R6.1
LED7
  Bottom 0.305: U$2.P3 42.41,48.6 42.07,48.26 42.07,46.91 41.35,46.2 36.59,46.2 31.04,40.64 31.04,34.72 R7.1
LED8
  Bottom 0.305: U$2.P8 44.46,51.1 44.77,50.88 44.77,47.55 42.47,45.24 42.55,26.99 43.81,25.72 43.81,23.42 44.37,22.86 47.86,22.86 48.42,22.3 48.42,21.62 R8.1
LED9  (via drill 0.5)
  Top 0.305: v62.55,48.97 62.55,32.07 v62.63,31.99
  Bottom 0.305: U$2.P42 60.84,50.6 v62.55,48.97 | v62.63,31.99 62.71,31.99 68.66,26.04 68.66,21.3 R9.1
LED10  (via drill 0.5)
  Top 0.305: v61.52,35.08 v61.52,47.78
  Bottom 0.305: R10.1 v61.52,35.08 | v61.52,47.78 61.52,49.21 60.64,50.09 54.88,50.09 U$2.P43
LED_STATUS
  Bottom 0.305: R28.1 41.51,43.86 41.51,45.64 42.55,46.67 42.55,47.86 42.78,48.1 U$2.P2
N$1
  Bottom 0.305: R11.2 77.15,69.37 77.85,69.37 78.49,70.01 78.49,70.26 78.49,71.42 TOUCH1.PAD
N$2
  Bottom 0.305: R12.2 62.09,79.1 60.96,80.26 60.96,81.67 TOUCH2.PAD
N$3
  Bottom 0.305: R13.2 39.79,79.16 40.64,80.01 40.64,81.61 TOUCH3.PAD
N$4
  Bottom 0.305: TOUCH4.PAD 23.3,68.6 R14.2
N$5
  Bottom 0.305: TOUCH5.PAD 20,60.88 21.35,60.88 23.13,59.1 23.17,59.1 R15.2
N$6
  Bottom 0.305: R16.2 19.99,40.64 TOUCH6.PAD
N$7
  Bottom 0.305: TOUCH7.PAD 23.03,31.58 22.1,32.51 21.94,32.77 R17.2
N$8
  Bottom 0.305: TOUCH8.PAD 40.55,21.43 41.07,22.02 41.07,24.44 R18.2
N$9
  Bottom 0.305: TOUCH9.PAD 60.81,21.23 60.2,21.84 R19.2
N$10
  Bottom 0.305: TOUCH0.PAD 78.39,31.08 77.98,31.5 77.22,31.5 76.71,32 76.71,32.93 R20.2
N$11
  Bottom 0.305: TOUCHHOOK.P$1 76.84,41.85 76.78,41.85 76.36,41.43 76.36,40.02 R21.2
N$12
  Bottom 0.305: R1.2 82.52,69.4 82.39,69.53 82.42,77.24 LED1.A
N$13
  Bottom 0.305: R2.2 65.72,80.25 64.69,81.28 64.64,88.16 LED2.A
N$14
  Bottom 0.305: R3.2 45.24,80.17 44.29,81.12 44.32,88.16 LED3.A
N$15
  Bottom 0.305: R4.2 27.81,76.99 LED4.A
N$16
  Bottom 0.305: 28.76,58.63 R5.2 27.49,60.4 23.34,60.4 21.26,62.48 16.71,62.48 LED5.A
N$17
  Bottom 0.305: LED6.A 15.41,39.51 15.84,39.08 25.77,39.08 26.67,40.01 26.67,40.53 R6.2
N$18
  Bottom 0.305: R7.2 26.54,24.06 LED7.A
N$19
  Bottom 0.305: R8.2 44.48,21.62 43.81,20.95 43.84,13.66 LED8.A
N$20
  Bottom 0.305: R9.2 65.83,21.46 64.61,20.24 64.64,14.15 LED9.A
N$21
  Bottom 0.305: LED10.A 80.95,23.99 80.72,24.21 80.79,32.48 78.18,35.08 R10.2
N$22
  Bottom 0.406: R22.2 U2.5
N$23
  Top 0.305: R24.2 27.42,53.33 LED11.A
N$24
  Bottom 0.305: R23.1 49.95,74.69 50.65,74.09 LED12.A
N$25
  Bottom 0.305: U2.1 50.3,68.64 LED12.C
N$26
  Bottom 0.305: C19.2 R27.1 89.4,65.11 90.01,65.72 90.01,68.98 J1.3
N$27
  Bottom 0.305: R26.1 C20.2 89.46,69.45 J1.2
N$28
  Bottom 0.406: L1.2 91.68,71.2 J1.1
N$29
  Bottom 0.305: R28.2 39.44,41.53 LED13.A
N$30
  Bottom 0.305: 51.91,66.4 51.91,68.74 52.31,69.14 52.31,74.69 50.8,76.2 46.12,76.2 45.8,76.52 45.8,78.34 46.12,78.66 46.59,78.66 46.83,78.82 46.83,82.15 48.58,83.9 49.4,83.9 U$11.2
  Bottom 0.406: U1.1 51.91,66.4 50.05,66.4 F1.2
N$31
  Bottom 0.813: 91.22,50.88 C1.2 | 92.89,50.89 U$21.P$1
  Bottom 1.016: L2.2 91.22,50.88 | C1.2 92.89,50.89
N$32
  Bottom 0.305: U1.3 52.83,68.3 52.78,68.5 52.78,74.93 50.8,76.91 50.8,77.87 50.01,78.66 47.55,78.66 47.31,78.9 47.31,81.84 48.58,83.11 49.93,83.11 50.16,83.34 50.16,84.69 49.93,84.93 U$11.C
RCC_OSC_IN
  Bottom 0.305: Y1.1 41.3,46.85 41.59,47.15 41.59,48.58 42.62,49.61 U$2.P5
RCC_OSC_OUT
  Bottom 0.305: Y1.3 41.56,49.26 42.39,50.09 43.54,50.09 U$2.P6
RESET  (via drill 0.5)
  Top 0.305: v42.15,50.8 45.72,50.8 46.59,51.67 48.66,51.67 49.13,51.2 49.13,49.93 49.53,49.53 50.56,49.53 50.88,49.85 73.58,49.85 73.82,49.61 74.61,49.61 75.01,50.01 75.01,50.64 75.56,51.2 80.88,51.2 81.76,52.07 81.76,58.74 82.39,59.37 88.58,59.37 v88.98,58.98
  Bottom 0.305: U$2.P7 42.42,50.6 v42.15,50.8 | v88.98,58.98 R25.1 88.98,60.73 SW1.P$1
RFM69_RESET  (via drill 0.5 pad 0.3)
  Top 0.305: v45.88,55.8 45.88,54.85 44.61,53.58 44.61,52.55 44.93,52.23 52.63,52.23 53.5,51.36 64.85,51.36 65.56,52.07 v80.33,52.07
  Bottom 0.305: U$2.P18 45.96,55.88 v45.88,55.8 | v80.33,52.07 80.33,63.17 U$15.RESET
RFM69_SPI_MISO  (via drill 0.5 pad 0.3)
  Top 0.305: U$22.SD_MISO 49.53,25.56 56.04,32.07 56.04,40.64 55.32,41.35 v55.32,42.78
  Bottom 0.305: U$15.MISO 72.2,61.57 70.17,59.53 67.07,59.53 65.8,58.26 65.8,43.34 65.25,42.78 v55.32,42.78 53.26,42.78 51.46,44.58 U$2.P52
RFM69_SPI_MOSI  (via drill 0.5 pad 0.3)
  Top 0.305: U$22.SD_MOSI 52.07,25.48 56.52,29.92 56.52,41.27 v56.2,41.59
  Bottom 0.305: U$15.MOSI 74.2,61.58 71.52,59.05 67.31,59.05 66.36,58.1 66.36,43.1 65.25,41.99 56.2,41.99 | U$2.P53 50.96,44.37 53.34,41.99 56.2,41.99 | v56.2,41.59 56.2,41.99
RFM69_SPI_NSS  (via drill 0.5 pad 0.3)
  Top 0.305: v64.85,45.32 v67.71,45.32
  Bottom 0.305: U$15.NSS 78.2,61.62 74.69,58.1 67.79,58.1 67.39,57.71 67.39,45.64 v67.71,45.32 | U$2.P50 52.46,45.01 53.1,44.37 63.9,44.37 v64.85,45.32
RFM69_SPI_SCK  (via drill 0.5 pad 0.3)
  Top 0.305: v64.93,43.74 v67.23,43.74 | U$22.SD_SCK 46.99,25.56 55.56,34.13 55.56,40.4 54.53,41.43 54.53,43.42 v54.37,43.58
  Bottom 0.305: U$15.SCK 76.2,61.6 73.1,58.58 67.55,58.58 66.91,57.94 66.91,44.05 v67.23,43.74 | U$2.P51 51.96,44.8 53.18,43.58 v54.37,43.58 64.77,43.58 v64.93,43.74
RMF69_INTERRUPT_DIO0  (via drill 0.5 pad 0.3)
  Top 0.305: v74.22,50.4 50.09,50.4 v50.01,50.48
  Bottom 0.305: U$2.P24 48.96,51.92 50.01,50.88 v50.01,50.48 | U$15.DIO0 74.2,50.39 v74.22,50.4
RMF69_INTERRUPT_DIO1  (via drill 0.5 pad 0.3)
  Top 0.305: v72.15,51.2 65.41,51.2 65.09,50.88 53.26,50.88 52.94,51.2 51.51,51.2 v51.44,51.28
  Bottom 0.305: U$15.DIO1 72.2,51.14 v72.15,51.2 | v51.44,51.28 51.44,51.91 51.99,52.47 51.99,56.98 U$2.P30
SD_CS  (via drill 0.5 pad 0.3)
  Top 0.305: U$22.SD_CS 54.61,25.56 56.99,27.94 56.99,42.94 53.02,46.91 49.13,46.91 v48.97,47.07
  Bottom 0.305: v48.97,47.07 48.97,45.72 U$2.P57
SYS_JTCK-SWCLK  (via drill 0.5)
  Top 0.305: v51.44,48.5 40.72,48.5 39.21,46.75 20.08,46.75 17.15,49.69 STLINK.SWDCLK
  Bottom 0.305: U$2.P49 52.96,46.97 v51.44,48.5
SYS_JTMS_SWDIO  (via drill 0.5)
  Top 0.305: v58.9,48.1 57.94,49.05 51.99,49.05 51.75,49.29 51.12,49.29 50.8,48.97 40.32,48.97 38.89,47.23 20.32,47.23 17.38,50.16 5.37,50.16 STLINK.SWDIO
  Bottom 0.305: U$2.P46 58.39,48.6 v58.9,48.1
TIM_IR_CARRIER_FREQ  (via drill 0.5)
  Top 0.305: v48.1,50.88 48.1,49.93 47.62,49.45 35.4,49.45 34.69,48.74 32.62,48.74 29.92,51.44 29.92,57.5 LED11.K
  Bottom 0.305: U$2.P61 46.96,46.49 47.7,47.23 47.7,50.48 v48.1,50.88
TSC_G1_IO1
  Bottom 0.305: U$2.P14 25.21,54.1 23.65,52.55 23.65,44.53 24.84,43.34 27.3,43.34 28.18,42.47 28.18,31.51 30.08,29.61 38.89,29.61 42.86,25.64 42.86,24.66 R18.1
TSC_G1_IO2
  Bottom 0.305: U$2.P15 25,54.6 23.18,52.78 23.18,44.29 24.61,42.86 26.99,42.86 27.7,42.15 27.7,38.81 26.67,37.86 24.77,37.86 23.65,36.75 23.65,33.12 R17.1
TSC_G1_IO3
  Bottom 0.305: U$2.P16 24.78,55.1 22.7,53.02 22.7,44.05 23.73,43.02 23.73,40.66 R16.1
TSC_G1_IO4
  Bottom 0.305: U$2.P17 45.46,59.27 C23.1
TSC_G2_IO1
  Bottom 0.305: U$2.P20 46.96,55.77 46.2,55.01 45.56,55.01 45.01,55.56 45.01,55.8 34.37,66.44 26.73,66.44 25,68.18 24.98,68.21 R14.1
TSC_G2_IO2
  Bottom 0.305: U$2.P21 47.46,55.48 46.43,54.45 45.32,54.45 44.53,55.24 44.53,55.48 42.7,57.31 26.81,57.31 R15.1
TSC_G2_IO3
  Bottom 0.305: U$2.P22 47.96,59.36 C24.1
TSC_G3_IO1
  Bottom 0.305: U$2.P25 49.46,57.77 48.66,58.58 48.66,62.87 47.7,63.82 40.4,63.82 38.34,65.88 38.34,74.53 39.85,76.04 R13.1
TSC_G3_IO2
  Bottom 0.305: U$2.P26 49.96,57.99 49.21,58.74 49.21,62.79 50.32,63.9 60.33,63.9 61.91,65.48 R12.1
TSC_G3_IO3
  Bottom 0.305: U$2.P27 50.46,58.2 49.77,58.9 49.77,62.39 50.72,63.34 64.77,63.34 70.8,69.37 R11.1
TSC_G3_IO4
  Bottom 0.305: U$2.P28 50.96,59.23 C22.1
TSC_G5_IO1
  Bottom 0.305: R21.1 72.27,39.97 69.29,36.99 57.63,36.99 50.01,44.61 50.01,45.66 U$2.P55
TSC_G5_IO2
  Bottom 0.305: R20.1 61.04,32.86 49.45,44.45 U$2.P56
TSC_G5_IO3
  Bottom 0.305: R19.1 61.89,31.22 48.5,44.61 48.5,45.67 U$2.P58
TSC_G5_IO4
  Bottom 0.305: U$2.P59 47.96,41.55 C25.1
USB_DM
  Bottom 0.305: U$2.P44 59.22,49.6 60.25,48.58 60.25,47.39 60.64,46.99 62.55,46.99 64.77,49.21 64.77,61.59 69.14,65.96 86.05,65.96 R26.2
USB_DP
  Bottom 0.305: R27.2 86.73,65.11 86.36,65.48 69.45,65.48 65.25,61.28 65.25,48.97 62.79,46.51 60.4,46.51 59.69,47.23 59.69,48.42 58.98,49.1 54.91,49.1 U$2.P45
VCC  (via drill 0.5, 0.5 pad 0.3)  (1 unrouted)
  Top 0.305: STLINK.VCC 3.81,54.77 7.94,50.64 17.62,50.64 20.56,47.7 27.78,47.7 v28.73,48.66
  Top 0.406: v56.59,66.36 v56.59,61.28 56.52,61.36 47.62,61.36 46.59,60.33 v46.59,58.5 46.59,58.02 46.75,57.86 46.75,54.37 v45.48,53.1 | v63.9,46.28 72.07,46.28 v76.2,50.4
  Bottom 0.305: U$2.P64 45.4,45.56 | 43.96,41.46 C21.2 | U$2.P13 39.95,53.6 C15.2 | 52.94,56.75 U$2.P32 | 45.4,45.8 45.4,45.77 U$2.P64 45.38,45.63
  Bottom 0.356: 52.94,48.34 52.94,56.75
  Bottom 0.381: U$2.P32 52.96,57.6 53.16,57.8 | 55.83,47.35 55.58,47.6 U$2.P48 53.68,47.6 52.94,48.34 | U$2.P13 44.98,53.6 | U$2.P19 46.46,58.37
  Bottom 0.406: 53.16,57.8 54.06,57.8 54.56,58.3 C14.2 C16.2 54.59,61.28 v56.59,61.28 | 55.83,47.35 55.83,46.98 C13.2 63.63,46.01 v63.9,46.28 | 43.96,41.46 C12.2 44.96,44.66 45.18,44.66 45.38,45.01 45.38,45.63 | U1.5 56.55,66.4 v56.59,66.36 59.69,69.45 U$22.VCC | C15.2 39.28,53.09 38.42,52.23 34.21,52.23 33.5,52.94 31.83,52.94 28.73,49.21 v28.73,48.66 28.73,45.53 U3.2 | 44.98,53.6 v45.48,53.1 45.48,47.62 45.4,47.55 45.4,45.8 | 46.46,58.37 v46.59,58.5 | U$15.3.3V v76.2,50.4 80.25,50.4 81.52,51.67 81.52,59.21 82.89,60.59 R25.2
VCC0  (via drill 0.5)
  Top 0.406: v58.9,62.55 59.13,62.79 59.13,67.63 58.26,68.5 47.78,68.5 44.05,72.23 43.18,72.23 v42.55,72.87
  Bottom 0.406: U2.4 46.65,70.74 46.3,71.09 46.3,74.69 | 46.3,74.69 R23.2 | 46.3,74.69 C18.2 43.34,74.69 42.55,73.9 v42.55,72.87 | L1.1 85.33,71.2 84.77,70.64 84.77,67.55 83.74,66.52 68.9,66.52 65.17,62.79 59.13,62.79 v58.9,62.55
VCC1
  Bottom 0.406: F1.1 U2.3 45.4,68.64 C17.2 40.25,68.94 CN1.1

### Text on the board
_bsilk: On | RESET